# Altium schematic sheet C11204_boosterTI.SchDoc: CSN Detector V5
size A4; Author: RCP; DrawnBy: RCP; Address1: LIM-HGGM; Address3: RCP; DocumentNumber: 1; Revision: 1; SheetNumber: 1; SheetTotal: 2; PageSetup: Record=PageOptions|CenterHorizontal=True|CenterVertical=True|PrintScale=0.97|XCorrection=1.00|YCorrection=1.00|PrintKind=0|BorderSize=5000000|LeftOffset=0|BottomOffset=0|Orientation=2|PaperLength=2970|PaperWidth=2100|Scale=100|PaperSource=7|PrintQuality=600|MediaType=1|DitherType=10|PaperKind=A4|PrintScaleMode=1
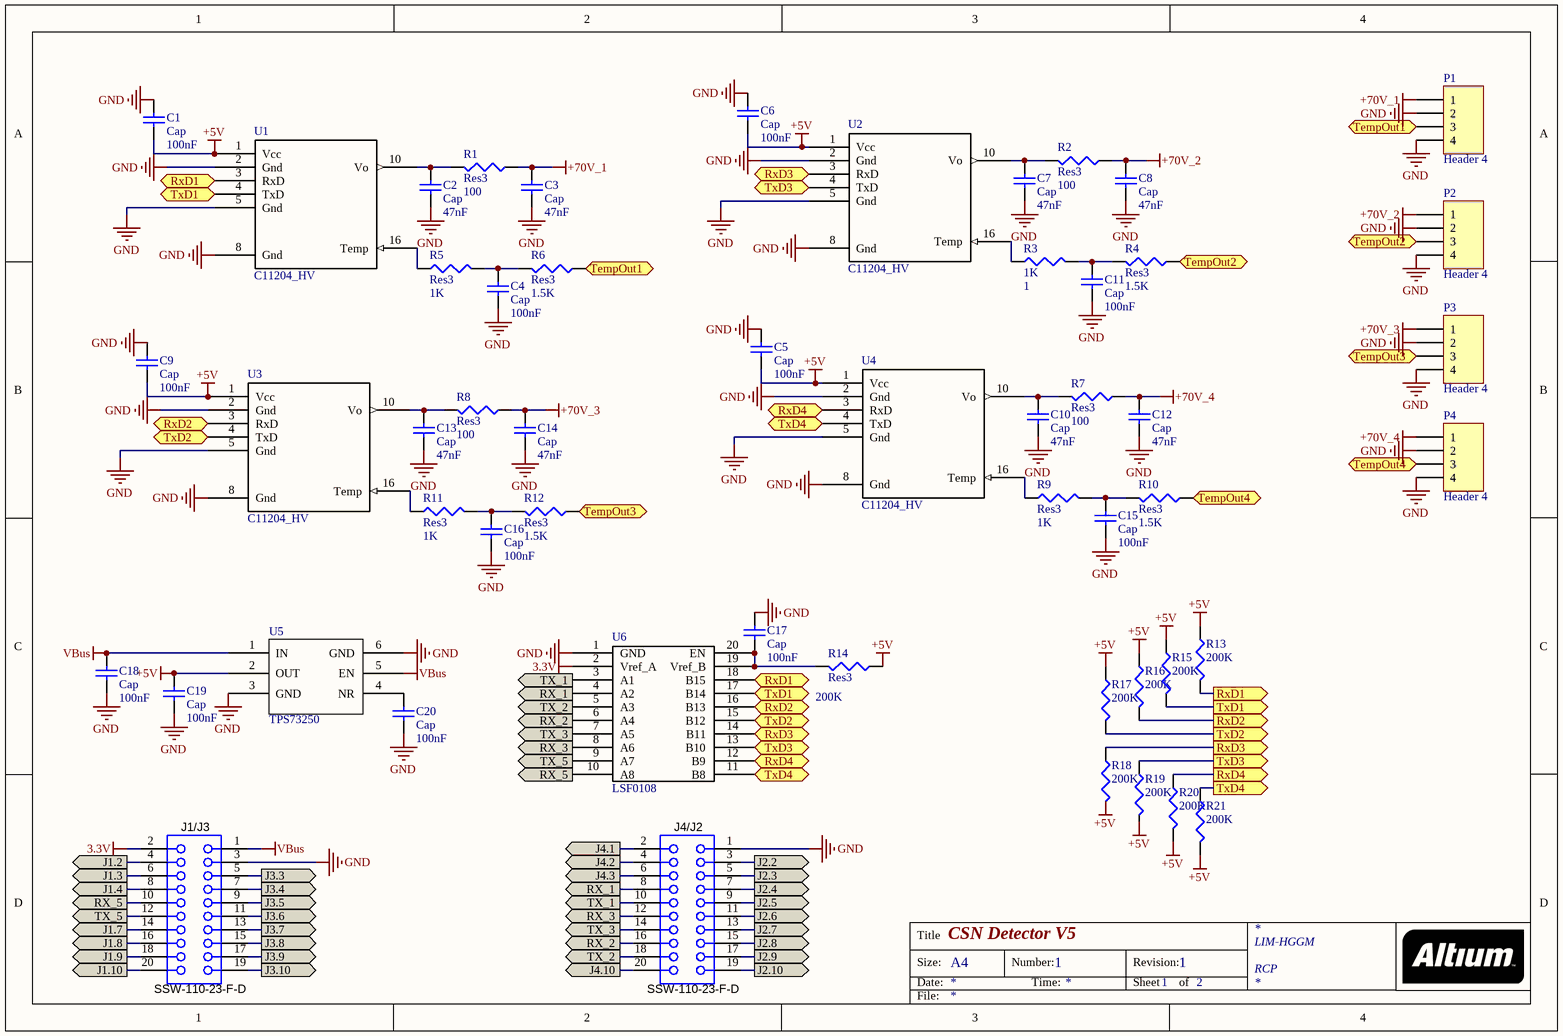
[diagram p0: C11204_boosterTI.SchDoc]

## Parts
C1  Cap  value 100nF  [J1-0603]
C2  Cap  value 47nF  [J1-0603]
C3  Cap  value 47nF  [J1-0603]
C4  Cap  value 100nF  [J1-0603]
C5  Cap  value 100nF  [J1-0603]
C6  Cap  value 100nF  [J1-0603]
C7  Cap  value 47nF  [J1-0603]
C8  Cap  value 47nF  [J1-0603]
C9  Cap  value 100nF  [J1-0603]
C10  Cap  value 47nF  [J1-0603]
C11  Cap  value 100nF  [J1-0603]
C12  Cap  value 47nF  [J1-0603]
C13  Cap  value 47nF  [J1-0603]
C14  Cap  value 47nF  [J1-0603]
C15  Cap  value 100nF  [J1-0603]
C16  Cap  value 100nF  [J1-0603]
C17  Cap  value 100nF  [C0805]
C18  Cap  value 100nF  [C0805]
C19  Cap  value 100nF  [C0805]
C20  Cap  value 100nF  [C0805]
J1/J3  SSW-110-23-F-D  [CONN_SSW-110-23-F-D]
J4/J2  SSW-110-23-F-D  [CONN_SSW-110-23-F-D]
P1  Header 4  [HDR1X4]
P2  Header 4  [HDR1X4]
P3  Header 4  [HDR1X4]
P4  Header 4  [HDR1X4]
R1  Res3  value 100  [J1-0603]
R2  Res3  value 100  [J1-0603]
R3  1K  value 1  [J1-0603]
R4  Res3  value 1.5K  [J1-0603]
R5  Res3  value 1K  [J1-0603]
R6  Res3  value 1.5K  [J1-0603]
R7  Res3  value 100  [J1-0603]
R8  Res3  value 100  [J1-0603]
R9  Res3  value 1K  [J1-0603]
R10  Res3  value 1.5K  [J1-0603]
R11  Res3  value 1K  [J1-0603]
R12  Res3  value 1.5K  [J1-0603]
R13  value 200K  [J1-0603]  (hidden comment: Res3)
R14  Res3  value 200K  [J1-0603]
R15  value 200K  [J1-0603]  (hidden comment: Res3)
R16  value 200K  [J1-0603]  (hidden comment: Res3)
R17  value 200K  [J1-0603]  (hidden comment: Res3)
R18  value 200K  [J1-0603]  (hidden comment: Res3)
R19  value 200K  [J1-0603]  (hidden comment: Res3)
R20  value 200K  [J1-0603]  (hidden comment: Res3)
R21  value 200K  [J1-0603]  (hidden comment: Res3)
U1  C11204_HV  [C11204_HAM]
U2  C11204_HV  [C11204_HAM]
U3  C11204_HV  [C11204_HAM]
U4  C11204_HV  [C11204_HAM]
U5  TPS73250  [SOT-223-DC5_M]
U6  LSF0108  [TSSOP20_M]

## Ports
J1.2, J1.3, J1.4, J1.7, J1.8, J1.9, J1.10, J2.2, J2.3, J2.4, J2.5, J2.6, J2.7, J2.8, J2.9, J2.10, J3.3, J3.4, J3.5, J3.6, J3.7, J3.8, J3.9, J3.10, J4.1, J4.2, J4.3, J4.10, RX_1, RX_2, RX_3, RX_5, RxD1 (out), RxD2 (out), RxD3 (out), RxD4 (out), TempOut1 (out), TempOut2 (out), TempOut3 (out), TempOut4 (out), TX_1, TX_2, TX_3, TX_5, TxD1 (out), TxD2 (out), TxD3 (out), TxD4 (out)

## Nets
3.3V: J1/J3.2 U6.2(Vref_A)
+5V: C1.2 C5.2 C6.2 C9.2 C19.1 R13.1 R14.1 R15.1 R16.1 R17.1 R20.2 R21.2 U1.1(Vcc) U2.1(Vcc) U3.1(Vcc) U4.1(Vcc) U5.2(OUT)
+70V_1: C3.2 P1.1 R1.1
+70V_2: C8.2 P2.1 R2.1
+70V_3: C14.2 P3.1 R8.1
+70V_4: C12.2 P4.1 R7.1
GND: C1.1 C2.1 C3.1 C4.1 C5.1 C6.1 C7.1 C8.1 C9.1 C10.1 C11.1 C12.1 C13.1 C14.1 C15.1 C16.1 C17.1 C18.1 C19.2 C20.1 J1/J3.3 J4/J2.1 P1.2 P1.4 P2.2 P2.4 P3.2 P3.4 P4.2 P4.4 U1.2(Gnd) U1.5(Gnd) U1.8(Gnd) U2.2(Gnd) U2.5(Gnd) U2.8(Gnd) U3.2(Gnd) U3.5(Gnd) U3.8(Gnd) U4.2(Gnd) U4.5(Gnd) U4.8(Gnd) U5.3(GND) U5.6(GND) U6.1(GND)
VBus: C18.2 J1/J3.1 U5.1(IN) U5.5(EN)
J1.2: J1/J3.4 ; port J1.2
J1.3: J1/J3.6 ; port J1.3
J1.4: J1/J3.8 ; port J1.4
J1.7: J1/J3.14 ; port J1.7
J1.8: J1/J3.16 ; port J1.8
J1.9: J1/J3.18 ; port J1.9
J1.10: J1/J3.20 ; port J1.10
J2.2: J4/J2.3 ; port J2.2
J2.3: J4/J2.5 ; port J2.3
J2.4: J4/J2.7 ; port J2.4
J2.5: J4/J2.9 ; port J2.5
J2.6: J4/J2.11 ; port J2.6
J2.7: J4/J2.13 ; port J2.7
J2.8: J4/J2.15 ; port J2.8
J2.9: J4/J2.17 ; port J2.9
J2.10: J4/J2.19 ; port J2.10
J3.3: J1/J3.5 ; port J3.3
J3.4: J1/J3.7 ; port J3.4
J3.5: J1/J3.9 ; port J3.5
J3.6: J1/J3.11 ; port J3.6
J3.7: J1/J3.13 ; port J3.7
J3.8: J1/J3.15 ; port J3.8
J3.9: J1/J3.17 ; port J3.9
J3.10: J1/J3.19 ; port J3.10
J4.1: J4/J2.2 ; port J4.1
J4.2: J4/J2.4 ; port J4.2
J4.3: J4/J2.6 ; port J4.3
J4.10: J4/J2.20 ; port J4.10
RX_1: J4/J2.8 U6.4(A2) ; port RX_1
RX_2: J4/J2.16 U6.6(A4) ; port RX_2
RX_3: J4/J2.12 U6.8(A6) ; port RX_3
RX_5: J1/J3.10 U6.10(A8) ; port RX_5
RxD1: R13.2 U1.3(RxD) U6.18(B15) ; port RxD1
RxD2: R16.2 U3.3(RxD) U6.16(B13) ; port RxD2
RxD3: R18.1 U2.3(RxD) U6.14(B11) ; port RxD3
RxD4: R20.1 U4.3(RxD) U6.12(B9) ; port RxD4
TempOut1: P1.3 R6.1 ; port TempOut1
TempOut2: P2.3 R4.1 ; port TempOut2
TempOut3: P3.3 R12.1 ; port TempOut3
TempOut4: P4.3 R10.1 ; port TempOut4
TX_1: J4/J2.10 U6.3(A1) ; port TX_1
TX_2: J4/J2.18 U6.5(A3) ; port TX_2
TX_3: J4/J2.14 U6.7(A5) ; port TX_3
TX_5: J1/J3.12 U6.9(A7) ; port TX_5
TxD1: R15.2 U1.4(TxD) U6.17(B14) ; port TxD1
TxD2: R17.2 U3.4(TxD) U6.15(B12) ; port TxD2
TxD3: R19.1 U2.4(TxD) U6.13(B10) ; port TxD3
TxD4: R21.1 U4.4(TxD) U6.11(B8) ; port TxD4
NetC2_2: C2.2 R1.2 U1.10(Vo)
NetC4_2: C4.2 R5.2 R6.2
NetC7_2: C7.2 R2.2 U2.10(Vo)
NetC10_2: C10.2 R7.2 U4.10(Vo)
NetC11_2: C11.2 R3.2 R4.2
NetC13_2: C13.2 R8.2 U3.10(Vo)
NetC15_2: C15.2 R9.2 R10.2
NetC16_2: C16.2 R11.2 R12.2
NetC17_2: C17.2 R14.2 U6.19(Vref_B) U6.20(EN)
NetC20_2: C20.2 U5.4(NR)
NetR3_1: R3.1 U2.16(Temp)
NetR5_1: R5.1 U1.16(Temp)
NetR9_1: R9.1 U4.16(Temp)
NetR11_1: R11.1 U3.16(Temp)

Not connected (* = marked no-connect by the designer): R18 2; R19 2; U1 6(NC) 7(HV) 9(NC) 11(NC) 12(NC) 13(NC) 14(NC) 15(NC); U2 6(NC) 7(HV) 9(NC) 11(NC) 12(NC) 13(NC) 14(NC) 15(NC); U3 6(NC) 7(HV) 9(NC) 11(NC) 12(NC) 13(NC) 14(NC) 15(NC); U4 6(NC) 7(HV) 9(NC) 11(NC) 12(NC) 13(NC) 14(NC) 15(NC)

## Notes on the sheet
- Labels drawn without touching a wire or pin: +5V
- Title
- Size:
- Date:
- A4
- Number:
- Time:
- Revision:
- Sheet
- of
- File:

## Library data of the parts
C1-C20 = Cap: Capacitor; Published: 8-Jun-2000; LatestRevisionDate: 17-Jul-2002; LatestRevisionNote: Re-released for DXP Platform.; PackageReference: RAD-0.3; Publisher: Altium Limited; PackageDescription: Radial Cap, Thru-Hole; 2 Leads; 0.3 in Pin Spacing
  C1 C5 C6 C9: Cod Farnell: 1735528
J1/J3 J4/J2 = SSW-110-23-F-D: Connector, Receptacle, 100mil, 10x2, Gold plated, TH; Manufacturer: Samtec, Inc.; SymbolCreator: a0412235; U/M: EA; SymbolVersion: 2013-02-28; PartNumber: SSW-110-23-F-D; CompType: Connector; RoHS: Y; PackageReference: HEADER, RECEPTACLE, 100mil, 10x2; MountType: TH; ComponentLink1Description: Datasheet Link; ComponentLink1URL: http://www.samtec.com/technical-specifications/default.aspx?SeriesMaster=SSW; Publisher: Texas Instruments; LatestRevisionDate: 2013-05-22
P1-P4 = Header 4: Header, 4-Pin; LatestRevisionDate: 17-Jul-2002; LatestRevisionNote: Re-released for DXP Platform.; Publisher: Altium Limited
R1-R21 = Res3: Resistor; Published: 8-Jun-2000; LatestRevisionDate: 29-May-2009; LatestRevisionNote: IPC-7351 Footprint Added.; PackageReference: J1-0603; Publisher: Altium Limited; PackageDescription: Chip Resistor